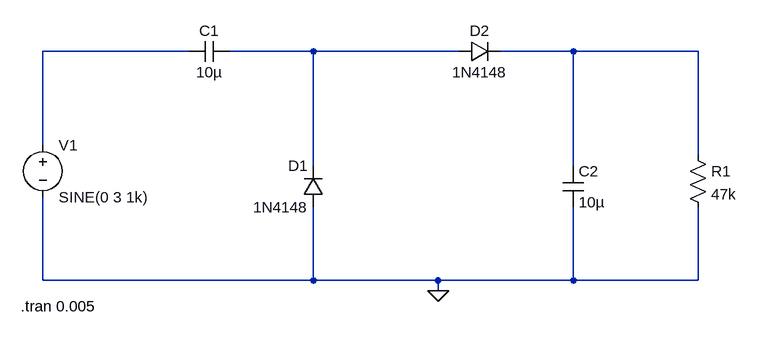
[diagram p0: schematic voltage doubler.asc]
voltage doubler.asc, the LTspice schematic file:
Version 4
SHEET 1 1140 680
WIRE 288 -32 64 -32
WIRE 480 -32 352 -32
WIRE 704 -32 480 -32
WIRE 880 -32 768 -32
WIRE 1072 -32 880 -32
WIRE 64 112 64 -32
WIRE 1072 128 1072 -32
WIRE 480 144 480 -32
WIRE 880 144 880 -32
WIRE 64 320 64 192
WIRE 480 320 480 208
WIRE 480 320 64 320
WIRE 672 320 480 320
WIRE 880 320 880 208
WIRE 880 320 672 320
WIRE 1072 320 1072 208
WIRE 1072 320 880 320
WIRE 672 336 672 320
FLAG 672 336 0
SYMBOL voltage 64 96 R0
WINDOW 123 0 0 Left 0
WINDOW 39 0 0 Left 0
SYMATTR InstName V1
SYMATTR Value SINE(0 3 1k)
SYMBOL cap 352 -48 R90
WINDOW 0 0 32 VBottom 2
WINDOW 3 32 32 VTop 2
SYMATTR InstName C1
SYMATTR Value 10µ
SYMBOL diode 496 208 R180
WINDOW 0 24 64 Left 2
WINDOW 3 24 0 Left 2
SYMATTR InstName D1
SYMATTR Value 1N4148
SYMBOL diode 704 -16 R270
WINDOW 0 32 32 VTop 2
WINDOW 3 0 32 VBottom 2
SYMATTR InstName D2
SYMATTR Value 1N4148
SYMBOL cap 864 144 R0
SYMATTR InstName C2
SYMATTR Value 10µ
SYMBOL res 1056 112 R0
SYMATTR InstName R1
SYMATTR Value 47k
TEXT 30 360 Left 2 !.tran 0.005

The netlist it stands for:
* voltage doubler.asc
V1 N001 0 SINE(0 3 1k)
C1 N002 N001 10µ
D1 0 N002 1N4148
D2 N002 N003 1N4148
C2 N003 0 10µ
R1 N003 0 47k
.model D D
.lib standard.dio
.tran 0.005
.backanno
.end